# Altium schematic sheet schGarra.SchDoc
size A4
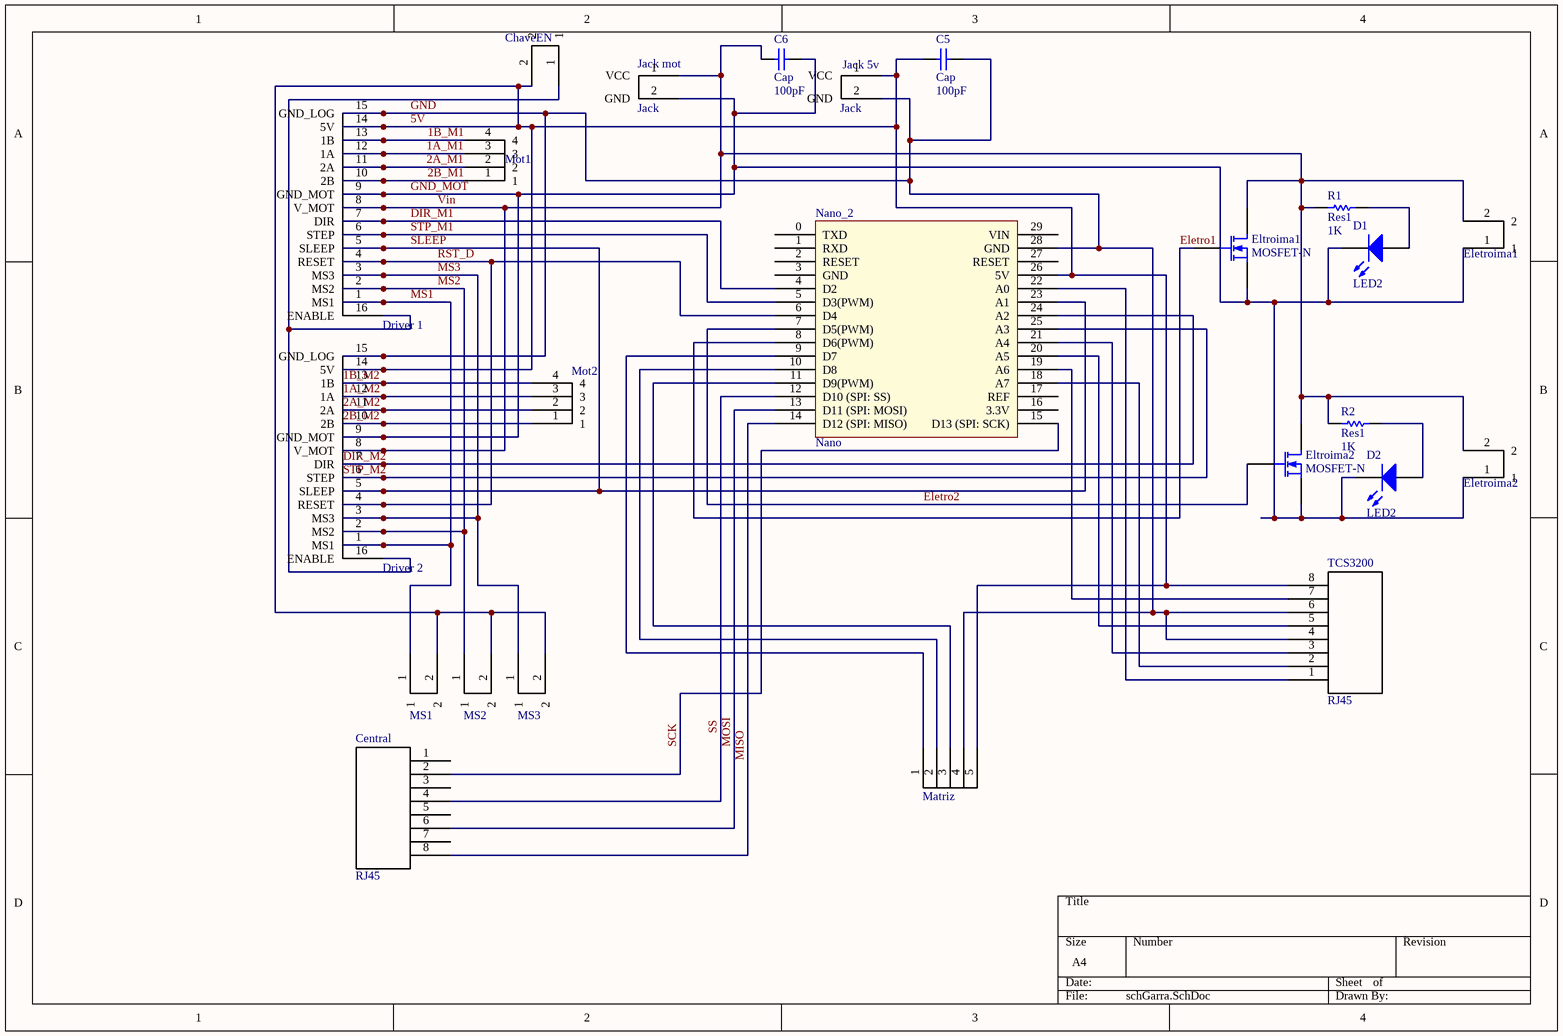
[diagram p0: schGarra.SchDoc]

## Parts
C5  Cap  value 100pF  [RAD-0.3]
C6  Cap  value 100pF  [RAD-0.3]
Central  RJ45  [RJ45_Simples]
ChaveEN  KK2  [2-vias]  (value not drawn)
D1  LED2  [2-vias]
D2  LED2  [2-vias]
Driver_1  A4988  [A4988]  (value not drawn)
Driver_2  A4988  [A4988]  (value not drawn)
Eletroima1  KK2  [2-vias]  (value not drawn)
Eletroima2  KK2  [2-vias]  (value not drawn)
Eltroima1  MOSFET-N  [3-vias]
Eltroima2  MOSFET-N  [3-vias]
Jack_5v  Jack  [JACK J4]
Jack_mot  Jack  [JACK J4]
Matriz  JTS-XH (5T)  [JTS-XH (5T)]  (value not drawn)
Mot1  KK4  [4-vias]  (value not drawn)
Mot2  KK4  [4-vias]  (value not drawn)
MS1  KK2  [2-vias]  (value not drawn)
MS2  KK2  [2-vias]  (value not drawn)
MS3  KK2  [2-vias]  (value not drawn)
Nano_2  Nano  [Arduino_Nano]
R1  Res1  value 1K  [AXIAL-0.3]
R2  Res1  value 1K  [AXIAL-0.3]
TCS3200  RJ45  [RJ45_Simples]

## Nets
1A_M1: Driver_1.12(1A) Mot1.3
1A_M2: Driver_2.12(1A) Mot2.3
1B_M1: Driver_1.13(1B) Mot1.4
1B_M2: Driver_2.13(1B) Mot2.4
2A_M1: Driver_1.11(2A) Mot1.2
2A_M2: Driver_2.11(2A) Mot2.2
2B_M1: Driver_1.10(2B) Mot1.1
2B_M2: Driver_2.10(2B) Mot2.1
5V: C5.1 ChaveEN.2 Driver_1.14(5V) Driver_2.14(5V) Jack_5v.1(VCC) Matriz.5 MS1.2 MS2.2 MS3.2 Nano_2.26(5V) TCS3200.8
DIR_M1: Driver_1.7(DIR) Nano_2.4(D2)
DIR_M2: Driver_2.7(DIR) Nano_2.24(A2)
Eletro1: Eltroima1.2(G) Nano_2.8(D6(PWM))
Eletro2: Eltroima2.2(G) Nano_2.7(D5(PWM))
GND: C5.2 Driver_1.15(GND_LOG) Driver_2.15(GND_LOG) Jack_5v.2(GND) Matriz.4 Nano_2.28(GND) TCS3200.4 TCS3200.6
GND_MOT: C6.2 D1.2(K) D2.2(K) Driver_1.9(GND_MOT) Driver_2.9(GND_MOT) Eletroima1.1 Eletroima2.1 Eltroima1.3(S) Eltroima2.3(S) Jack_mot.2(GND)
MISO: Central.8 Nano_2.14(D12_(SPI:_MISO))
MOSI: Central.6 Nano_2.13(D11_(SPI:_MOSI))
MS1: Driver_1.1(MS1) Driver_2.1(MS1) MS1.1
MS2: Driver_1.2(MS2) Driver_2.2(MS2) MS2.1
MS3: Driver_1.3(MS3) Driver_2.3(MS3) MS3.1
RST_D: Driver_1.4(RESET) Driver_2.4(RESET) Nano_2.6(D4)
SCK: Central.2 Nano_2.15(D13_(SPI:_SCK))
SLEEP: Driver_1.5(SLEEP) Driver_2.5(SLEEP) Nano_2.23(A1)
SS: Central.4 Nano_2.12(D10_(SPI:_SS))
STP_M1: Driver_1.6(STEP) Nano_2.5(D3(PWM))
STP_M2: Driver_2.6(STEP) Nano_2.25(A3)
Vin: C6.1 Driver_1.8(V_MOT) Driver_2.8(V_MOT) Eletroima1.2 Eletroima2.2 Eltroima1.1(D) Eltroima2.1(D) Jack_mot.1(VCC) R1.2 R2.1
NetChaveEN_1: ChaveEN.1 Driver_1.16(ENABLE) Driver_2.16(ENABLE)
NetD1_1: D1.1(A) R1.1
NetD2_1: D2.1(A) R2.2
NetMatriz_1: Matriz.1 Nano_2.9(D7)
NetMatriz_2: Matriz.2 Nano_2.10(D8)
NetMatriz_3: Matriz.3 Nano_2.11(D9(PWM))
NetNano_2_18: Nano_2.18(A7) TCS3200.2
NetNano_2_19: Nano_2.19(A6) TCS3200.7
NetNano_2_20: Nano_2.20(A5) TCS3200.5
NetNano_2_21: Nano_2.21(A4) TCS3200.3
NetNano_2_22: Nano_2.22(A0) TCS3200.1

Not connected (* = marked no-connect by the designer): Central 1(9) 3 5 7; Nano_2 0(TXD) 1(RXD) 2(RESET) 3(GND) 16(3.3V) 17(REF) 27(RESET) 29(VIN)

## Library data of the parts
C5 C6 = Cap: Capacitor; Published: 8-Jun-2000; LatestRevisionDate: 17-Jul-2002; LatestRevisionNote: Re-released for DXP Platform.; PackageReference: RAD-0.3; Publisher: Altium Limited; PackageDescription: Radial Cap, Thru-Hole; 2 Leads; 0.3 in Pin Spacing
ChaveEN Eletroima1 Eletroima2 MS1-MS3 = KK2Vias
D1 D2 = LED2: Typical RED, GREEN, YELLOW, AMBER GaAs LED; Published: 8-Jun-2000; LatestRevisionDate: 17-Jul-2002; LatestRevisionNote: Re-released for DXP Platform.; PackageVersion: Feb-2002; PackageReference: 3.2X1.6X1.1; Publisher: Altium Limited; PackageDescription: SM LED; 2 Flat Leads
Eltroima1 Eltroima2 = MOSFET-N: N-Channel MOSFET; Published: 8-Jun-2000; LatestRevisionDate: 17-Jul-2002; LatestRevisionNote: Re-released for DXP Platform.; PackageVersion: 1995/1996; PackageReference: E3; Publisher: Altium Limited; PackageDescription: TO, Flat Index; 3 In-Line, Axial Leads; Body Dia. 4.6mm; Lead Dia. 0.5 mm (max)
Mot1 Mot2 = KK4Vias: ComponentLink1Description: Fabricante; ComponentLink1URL: https://www.molex.com/molex/products/family?key=kk_254_rpc_connector_system&channel=products&chanName=family&pageTitle=Introduction&parentKey=kk_interconnect_solutions
Nano_2 = Arduino_Nano
R1 R2 = Res1: Resistor; Published: 8-Jun-2000; LatestRevisionDate: 17-Jul-2002; LatestRevisionNote: Re-released for DXP Platform.; PackageReference: AXIAL-0.3; Publisher: Altium Limited; PackageDescription: Axial Device, Thru-Hole; 2 Leads; 0.3 in Pin Spacing